# EAGLE design avray28 (EAGLE 9.4.1)
CNAME: AVR AY Emul / DIP28; CREVISION: 1.0; DESIGNER: Andy Karpov
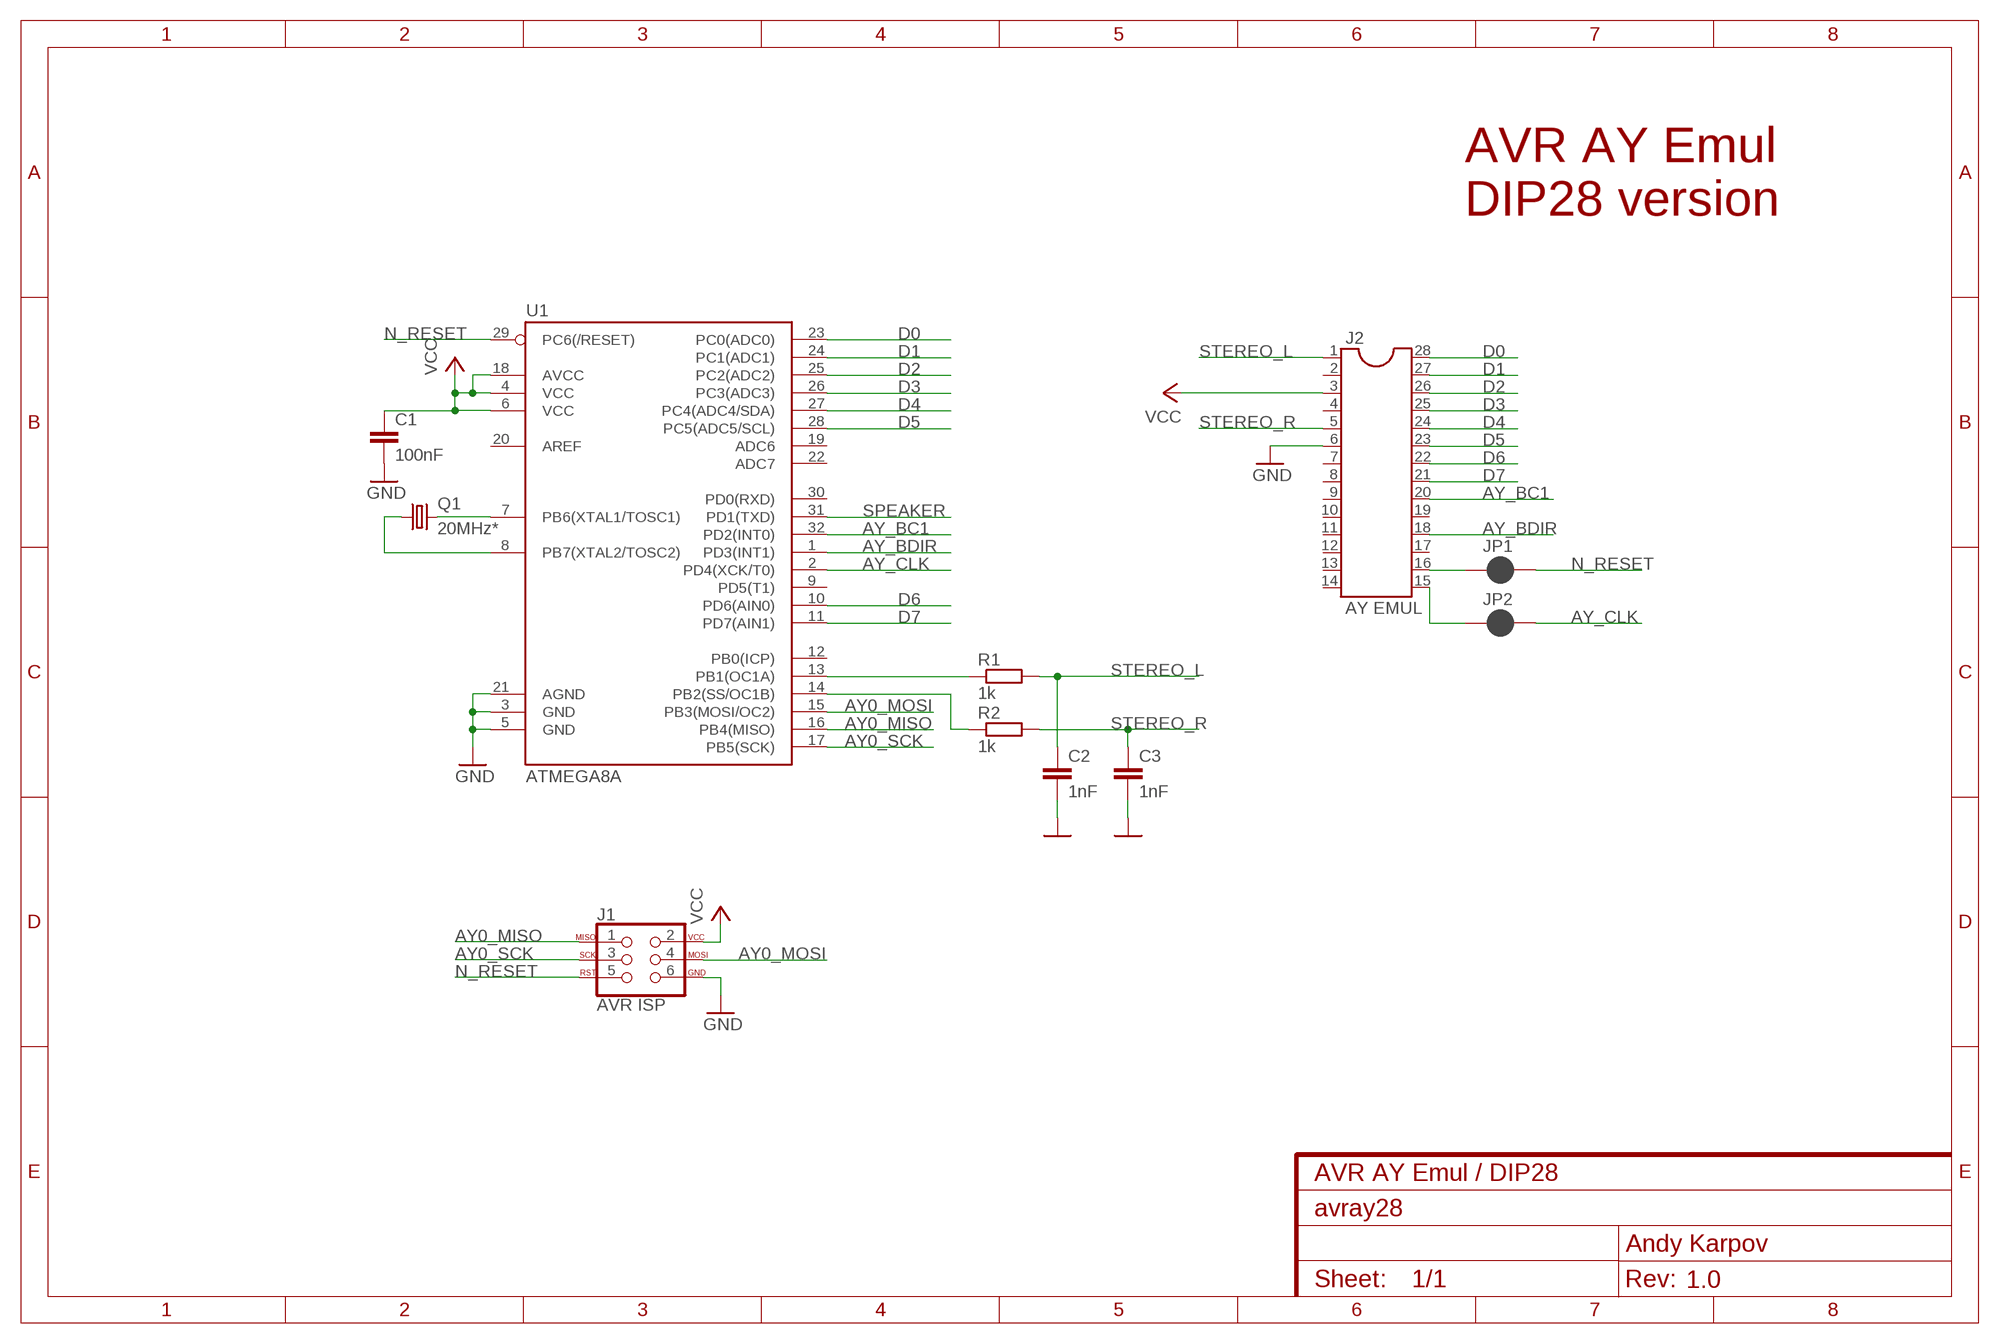
[diagram p0: schematic, sheet 1]

## Parts
C1  100nF  C-EUC0805  [C0805]
C2  1nF  C-EUC0805  [C0805]
C3  1nF  C-EUC0805  [C0805]
J1  AVR ISP  AVR_SPI_PROG_3X22X3_LOCK  [2X3_LOCK]
J2  AY EMUL  DIL28  [DIL28-6]
JP1  RST ENA  JUMPER-SMT_2_NC_PASTE_SILK  [SMT-JUMPER_2_NC_PASTE_SILK]
JP2  CLK ENA  JUMPER-SMT_2_NC_PASTE_SILK  [SMT-JUMPER_2_NC_PASTE_SILK]
Q1  20MHz*  CRYSTALHC49S  [HC49/S]
R1  1k  R-EU_R0805  [R0805]
R2  1k  R-EU_R0805  [R0805]
U1  ATMEGA8A  ATMEGA328P_TQFP  [TQFP32-08]

## Nets
AY0_MISO: J1.1 U1.16(PB4(MISO))
AY0_MOSI: J1.4 U1.15(PB3(MOSI/OC2))
AY0_SCK: J1.3 U1.17(PB5(SCK))
AY_BC1: J2.20 U1.32(PD2(INT0))
AY_BDIR: J2.18 U1.1(PD3(INT1))
AY_CLK: JP2.2 U1.2(PD4(XCK/T0))
D0: J2.28 U1.23(PC0(ADC0))
D1: J2.27 U1.24(PC1(ADC1))
D2: J2.26 U1.25(PC2(ADC2))
D3: J2.25 U1.26(PC3(ADC3))
D4: J2.24 U1.27(PC4(ADC4/SDA))
D5: J2.23 U1.28(PC5(ADC5/SCL))
D6: J2.22 U1.10(PD6(AIN0))
D7: J2.21 U1.11(PD7(AIN1))
GND [power]: C1.2 C2.2 C3.2 J1.6 J2.6 U1.3(GND) U1.5(GND) U1.21(AGND)
N$1: J2.16 JP1.1
N$2: J2.15 JP2.1
N$5: R1.1 U1.13(PB1(OC1A))
N$7: R2.1 U1.14(PB2(SS/OC1B))
N$8: Q1.2 U1.7(PB6(XTAL1/TOSC1))
N$9: Q1.1 U1.8(PB7(XTAL2/TOSC2))
N_RESET: J1.5 JP1.2 U1.29(PC6(/RESET))
SPEAKER: U1.31(PD1(TXD))
STEREO_L: C2.1 J2.1 R1.2
STEREO_R: C3.1 J2.5 R2.2
VCC [power]: C1.1 J1.2 J2.3 U1.4(VCC) U1.6(VCC) U1.18(AVCC)
Unconnected: J2.2 J2.4 J2.7 J2.8 J2.9 J2.10 J2.11 J2.12 J2.13 J2.14 J2.17 J2.19 U1.9(PD5(T1)) U1.12(PB0(ICP)) U1.19(ADC6) U1.20(AREF) U1.22(ADC7) U1.30(PD0(RXD))

## Notes on the sheet
- AVR AY Emul 
  DIP28 version

## Library data of the parts
C1-C3 = karabas_box:C-EU: CAPACITOR, European symbol
J1 = SparkFun-Connectors:AVR_SPI_PROG_3X2: AVR ISP 6 Pin This is the reduced ISP connector for AVR programming. Common on Arduino. This footprint will take up less PCB space and can be used with a 10-pin to 6-pin adapter such as SKU: BOB-08508 **Special note about "TEST_POINT" package. The stop mask is on the top side, so if you want your programming test points to be on the bottom of your board, make sure to place this package on the bottom side of the board. This also ensure that the orientation to program from the bottom side will be correct. SparkFun Products: SparkFun ISP Pogo Adapter <https://www.sparkfun.com/products/11591> - NS Tiny AVR Programmer <https://www.sparkfun.com/products/11801> -PTH
J2 = ic-package:DIL28: Dual In Line
JP1 JP2 = SparkFun-Jumpers:JUMPER-SMT_2_NC_PASTE: Normally closed solder jumper This jumper has an aperture in the stencil to allow solder paste to bridge the split in the wire so it's normally closed (NC). Wick off the solder to open the connection. Reapply solder to reclose the connection.
Q1 = karabas_box:CRYSTAL: CRYSTAL; OC_FARNELL: 1667008; OC_NEWARK: unknown
R1 R2 = karabas_box:R-EU_: RESISTOR, European symbol
U1 = SparkFun-IC-Microcontroller:ATMEGA328P_TQFP: Popular 328P in QFP Storefront component: ATmega328 - TQFP <https://www.sparkfun.com/products/13448> (COM-13448) Datasheet <http://www.sparkfun.com/datasheets/Components/SMD/ATMega328.pdf> SparkFun Products SparkFun RedBoard - Programmed with Arduino <https://www.sparkfun.com/products/12757> (DEV-12757) Arduino Pro Mini 328 - 5V/16MHz <https://www.sparkfun.com/products/11113> (DEV-11113) Arduino Pro Mini 328 - 3.3V/8MHz <https://www.sparkfun.com/products/11114> (DEV-11114) SparkFun OpenLog <https://www.sparkfun.com/products/13712> (DEV-13712) SparkFun MicroView - OLED Arduino Module <https://www.sparkfun.com/products/12923> (DEV-12923) SparkFun Digital Sandbox <https://www.sparkfun.com/products/12651> (DEV-12651) SparkFun PicoBoard <https://www.sparkfun.com/products/11888> (WIG-11888) Arduino Fio <https://www.sparkfun.com/products/10116> (DEV-10116) LilyPad Arduino 328 Main Board <https://www.sparkfun.com/products/13342> (DEV-13342) SparkFun RedStick <https://www.sparkfun.com/products/13741> (DEV-13741) LilyPad MP3 <https://www.sparkfun.com/products/11013> (DEV-11013) LilyPad Arduino SimpleSnap <https://www.sparkfun.com/products/10941> (DEV-10941) SparkFun Stepoko <https://www.sparkfun.com/products/13899> (ROB-13899) SparkFun Geiger Counter <https://www.sparkfun.com/products/11345> (SEN-11345) SparkFun EL Sequencer <https://www.sparkfun.com/products/12781> (COM-12781) Arduino Pro 328 - 5V/16MHz <https://www.sparkfun.com/products/10915> (DEV-10915) CryptoCape <https://www.sparkfun.com/products/12773> (DEV-12773) SparkFun IR Thermometer Evaluation Board - MLX90614 <https://www.sparkfun.com/products/10740> (SEN-10740) SparkFun RedBot Mainboard <https://www.sparkfun.com/products/12097> (ROB-12097) Arduino Pro 328 - 3.3V/8MHz <https://www.sparkfun.com/products/10914> (DEV-10914) SparkFun Block for Intel® Edison - Arduino <https://www.sparkfun.com/products/13036> (DEV-13036) SparkFun Simon Says - Surface Mount Soldering Kit <https://www.sparkfun.com/products/10935> (KIT-10935) SparkFun 7-Segment Serial Display - Red <https://www.sparkfun.com/products/11441> (COM-11441) SparkFun 7-Segment Serial Display - White <https://www.sparkfun.com/products/11629> (COM-11629) SparkFun 7-Segment Serial Display - Yellow <https://www.sparkfun.com/products/11443> (COM-11443) SparkFun 7-Segment Serial Display - Kelly Green <https://www.sparkfun.com/products/11440> (COM-11440) SparkFun 7-Segment Serial Display - Blue <https://www.sparkfun.com/products/11442> (COM-11442) SparkFun OpenSegment Serial Display - 20mm (Blue) <https://www.sparkfun.com/products/11647> (COM-11647) SparkFun OpenSegment Serial Display - 20mm (Green) <https://www.sparkfun.com/products/11646> (COM-11646) SparkFun OpenSegment Serial Display - 20mm (White) <https://www.sparkfun.com/products/11648> (COM-11648) SparkFun OpenSegment Serial Display - 20mm (Red) <https://www.sparkfun.com/products/11644> (COM-11644) SparkFun OpenSegment Serial Display - 20mm (Yellow) <https://www.sparkfun.com/products/11645> (COM-11645) SparkFun OpenSegment Shield <https://www.sparkfun.com/products/13190> (DEV-13190); PROD_ID: IC-09069; VALUE: ATMEGA328P_TQFP

## Net classes
0 default: width 0.178 mm, clearance 0.178 mm
1 power: width 0.305 mm, clearance 0.178 mm to class 0, clearance 0.229 mm

## Board
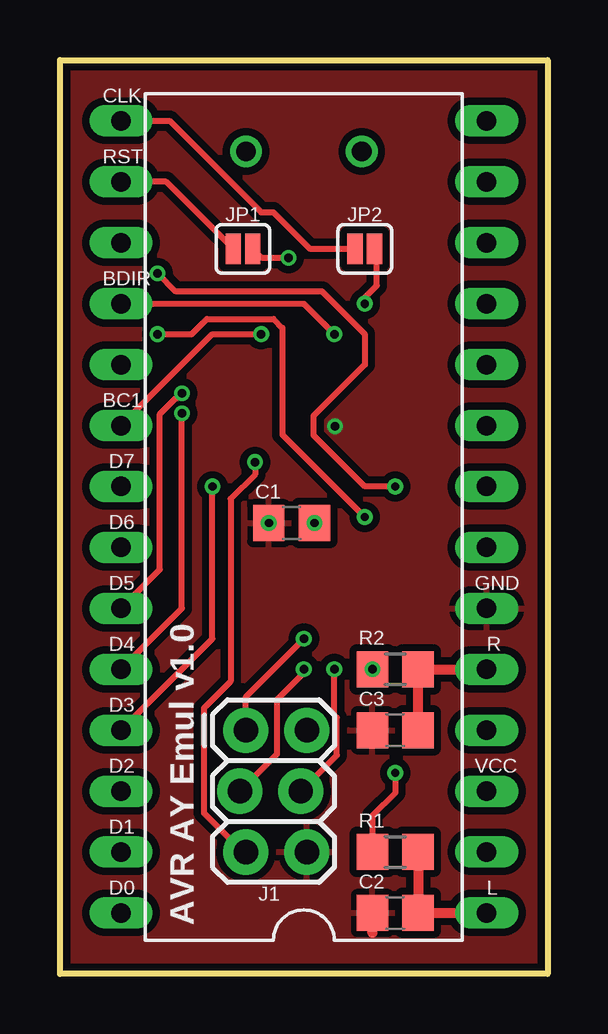
[diagram p1: board, top side]
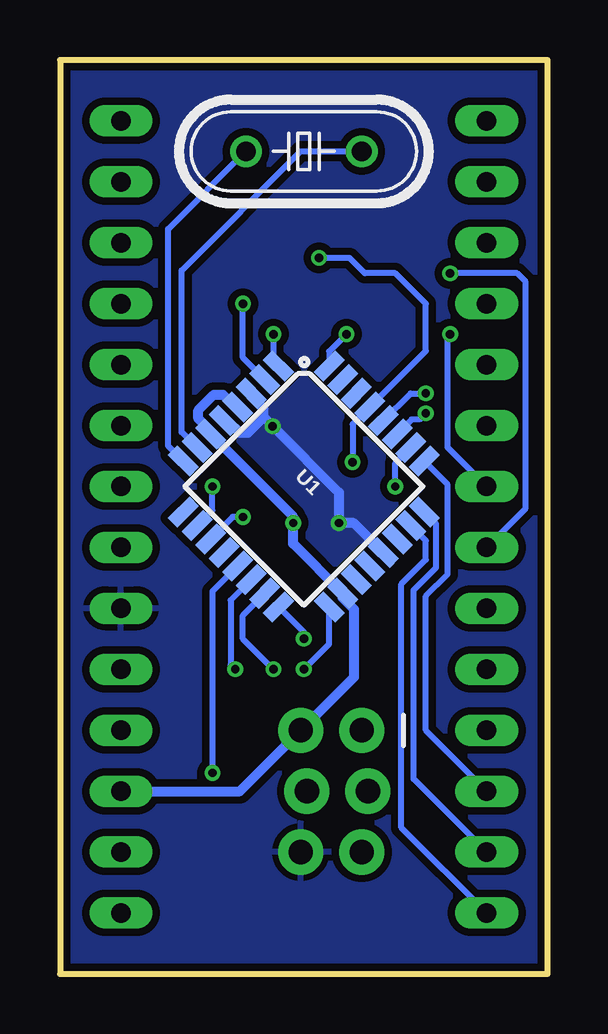
[diagram p2: board, bottom side, seen from below]

Size 20.32 x 38.1 mm. Coordinates in mm from the lower left corner, seen from the top.
Outline: 0,38.1 20.32,38.1 20.32,0 0,0 0,38.1
Copper layers (1*16): Top 0.035mm / dielectric 1.5mm / Bottom 0.035mm
Design rules "default": minimum track width 6mil, minimum drill 12mil, track to track 6mil, track to pad 6mil, pad to pad 6mil, via to via 6mil, smd to smd 0mil, copper to edge 10mil, drill to drill 10mil, minimum pad ring 10mil, minimum via ring 6mil, stop-mask expansion 2mil, vias tented up to drill 100mil, thermal gap 10mil

### Footprints (pad centres in the part's own frame; a part is rotated, then mirrored left to right if it is on the bottom)
C0805 = smd 1.3 x 1.5: 1 -0.95,0; 2 0.95,0
2X3_LOCK = drill 1.016 pad 1.88: 1 0,0.127; 2 0,2.667; 3 2.54,-0.127; 4 2.54,2.413; 5 5.08,0.127; 6 5.08,2.667
DIL28-6 = drill 0.813 long: 1 -16.51,-7.62; 2 -13.97,-7.62; 3 -11.43,-7.62; 4 -8.89,-7.62; 5 -6.35,-7.62; 6 -3.81,-7.62; 7 -1.27,-7.62; 8 1.27,-7.62; 9 3.81,-7.62; 10 6.35,-7.62; 11 8.89,-7.62; 12 11.43,-7.62; 13 13.97,-7.62; 14 16.51,-7.62; 15 16.51,7.62; 16 13.97,7.62; 17 11.43,7.62; 18 8.89,7.62; 19 6.35,7.62; 20 3.81,7.62; 21 1.27,7.62; 22 -1.27,7.62; 23 -3.81,7.62; 24 -6.35,7.62; 25 -8.89,7.62; 26 -11.43,7.62; 27 -13.97,7.62; 28 -16.51,7.62
SMT-JUMPER_2_NC_PASTE_SILK = smd 0.635 x 1.27: 1 -0.406,0; 2 0.406,0
HC49/S = drill 0.813: 1 -2.413,0; 2 2.413,0
R0805 = smd 1.3 x 1.5: 1 -0.95,0; 2 0.95,0
TQFP32-08 = smd 1.27 x 0.559: 1 -4.293,2.8; 2 -4.293,2; 3 -4.293,1.2; 4 -4.293,0.4; 5 -4.293,-0.4; 6 -4.293,-1.2; 7 -4.293,-2; 8 -4.293,-2.8; 17 4.293,-2.8; 18 4.293,-2; 19 4.293,-1.2; 20 4.293,-0.4; 21 4.293,0.4; 22 4.293,1.2; 23 4.293,2; 24 4.293,2.8 | smd 0.559 x 1.27: 9 -2.8,-4.293; 10 -2,-4.293; 11 -1.2,-4.293; 12 -0.4,-4.293; 13 0.4,-4.293; 14 1.2,-4.293; 15 2,-4.293; 16 2.8,-4.293; 25 2.8,4.293; 26 2,4.293; 27 1.2,4.293; 28 0.4,4.293; 29 -0.4,4.293; 30 -1.2,4.293; 31 -2,4.293; 32 -2.8,4.293

### Placement (x,y rotation side)
C1  9.65,18.8 180 top
C2  13.97,2.54 180 top
C3  13.97,10.16 180 top
J1  7.62,10.16 270 top
J2  10.16,19.05 90 top
JP1  7.62,30.23 0 top
JP2  12.7,30.23 0 top
Q1  10.16,34.29 0 bottom
R1  13.97,5.08 0 top
R2  13.97,12.7 0 top
U1  10.16,20.32 315 bottom

### Tracks (layer width: path | path; a pad name or v marks a point on that pad's centre or on a via)
AY0_MISO  (via drill 0.35)
  Top 0.254: J1.1 7.75,11.56 v10.16,13.97
  Bottom 0.254: v10.16,13.97 10.16,14.25 U1.16
AY0_MOSI  (via drill 0.35)
  Top 0.254: v11.43,12.7 11.43,10.78 11.53,10.68 11.53,9.12 J1.4
  Bottom 0.254: v11.43,12.7 12.7,13.97 12.7,14.95 U1.15
AY0_SCK  (via drill 0.35)
  Top 0.254: J1.3 9.04,9.17 9.04,11.44 10.16,12.55 v10.16,12.7
  Bottom 0.254: v10.16,12.7 9.11,13.76 U1.17
AY_BC1  (via drill 0.35)
  Top 0.254: J2.20 6.35,26.67 v8.38,26.67
  Bottom 0.254: v8.38,26.67 9.11,25.95 U1.32
AY_BDIR  (via drill 0.35)
  Top 0.254: J2.18 10.16,27.94 v11.43,26.67
  Bottom 0.254: v11.43,26.67 11.43,25.55 U1.1
AY_CLK  (via drill 0.35)
  Top 0.254: v12.7,27.94 12.7,28.19 13.21,28.7 13.21,30.12 JP2.2
  Bottom 0.254: U1.2 12.7,25.69 v12.7,27.94
D0
  Bottom 0.254: J2.28 6.1,6.1 6.1,16.26 5.08,17.27 5.08,18.07 U1.23
D1
  Bottom 0.254: J2.27 5.59,8.13 5.59,16 4.65,16.94 4.65,18.77 U1.24
D2
  Bottom 0.254: J2.26 5.08,10.16 5.08,15.75 4.17,16.66 4.17,20.4 U1.25
D3  (via drill 0.35)
  Top 0.254: J2.25 6.35,13.97 v6.35,20.32
  Bottom 0.254: v6.35,20.32 6.35,21.3 U1.26
D4  (via drill 0.35)
  Top 0.254: J2.24 5.08,15.24 v5.08,23.37
  Bottom 0.254: v5.08,23.37 5.33,23.11 5.67,23.11 U1.27
D5  (via drill 0.35)
  Top 0.254: J2.23 4.17,16.87 4.17,23.35 4.82,24 4.88,24 v5.08,24.2
  Bottom 0.254: U1.28 5.71,24.2 v5.08,24.2
D6  (via drill 0.35)
  Top 0.254: v4.06,29.21 4.83,28.45 10.92,28.45 12.7,26.67 12.7,25.4 10.57,23.27 10.57,22.45 12.7,20.32 v13.97,20.32
  Bottom 0.254: J2.22 0.91,19.41 0.91,28.85 1.27,29.21 v4.06,29.21 | U1.10 13.97,19.34 v13.97,20.32
D7  (via drill 0.35)
  Top 0.254: v4.06,26.67 5.49,26.67 6.12,27.3 8.9,27.3 9.27,26.93 9.27,22.48 v12.7,19.05
  Bottom 0.254: v4.06,26.67 4.17,26.57 4.17,21.95 J2.21 | v12.7,19.05 13.13,19.05 U1.11
GND  (via drill 0.35)
  Top 0.406: 12.83,2.54 C2.2 13.02,1.71
  Bottom 0.406: U1.21 8.07,18.8 C1.2 8.7,20.08 v11.46,22.83 11.83,23.21 | 11.83,23.21 12.48,22.56 12.84,22.56 13.35,23.07 U1.5 | 11.83,23.21 11.83,23.57 12.35,24.08 U1.3
  other vias: 8.7,18.8
  pour Top (isolate 0.305): 0,38.1 20.32,38.1 20.32,0 0,0
  pour Bottom (isolate 0.305): 0,38.1 20.32,38.1 20.32,0 0,0
N$1
  Top 0.254: JP1.1 4.42,33.02 J2.16
N$2
  Top 0.254: JP2.1 10.41,30.23 8.89,31.75 8.38,31.75 4.57,35.56 J2.15
N$5  (via drill 0.35)
  Top 0.254: v13.97,8.38 13.97,7.55 13.02,6.6 R1.1
  Bottom 0.254: U1.13 13.97,15.94 v13.97,8.38
N$7  (via drill 0.35)
  Bottom 0.254: R2.1 13.21,12.89 13.21,15.57 U1.14
  other vias: 13.02,12.7
N$8
  Bottom 0.254: U1.7 15.25,22.58 15.25,29.33 10.29,34.29 Q1.2
N$9
  Bottom 0.254: U1.8 15.81,22.02 15.81,31.05 Q1.1
N_RESET  (via drill 0.35)
  Top 0.254: v8.13,21.34 8.13,20.83 7.11,19.81 7.11,12.19 5.99,11.07 5.99,6.71 7.62,5.08 J1.5 | v9.53,29.84 8.41,29.84 JP1.2
  Bottom 0.254: v8.13,21.34 8.13,22.92 U1.29 5.08,25.97 5.08,27.94 6.35,29.21 7.62,29.21 8.26,29.84 v9.53,29.84
STEREO_L
  Top 0.406: R1.2 C2.1 J2.1
STEREO_R
  Top 0.406: C3.1 R2.2 J2.5
VCC  (via drill 0.35)
  Bottom 0.406: J2.3 12.83,7.62 J1.2 8.08,12.37 8.08,15.21 8.54,15.67 U1.18 10.6,17.93 C1.1 10.6,19.07 U1.6 14.04,22.63 14.56,23.14 14.56,23.5 13.91,24.15 13.53,24.15 13.02,23.64 U1.4
  other vias: 10.6,18.8

### Text on the board
tNames: CLK | RST | BDIR | BC1 | D7 | D6 | D5 | GND | D4 | R | D3 | D2 | VCC | D1 | D0 | L | AVR AY Emul v1.0